# EAGLE design NodeCallerId.cg2 (EAGLE 4.16)
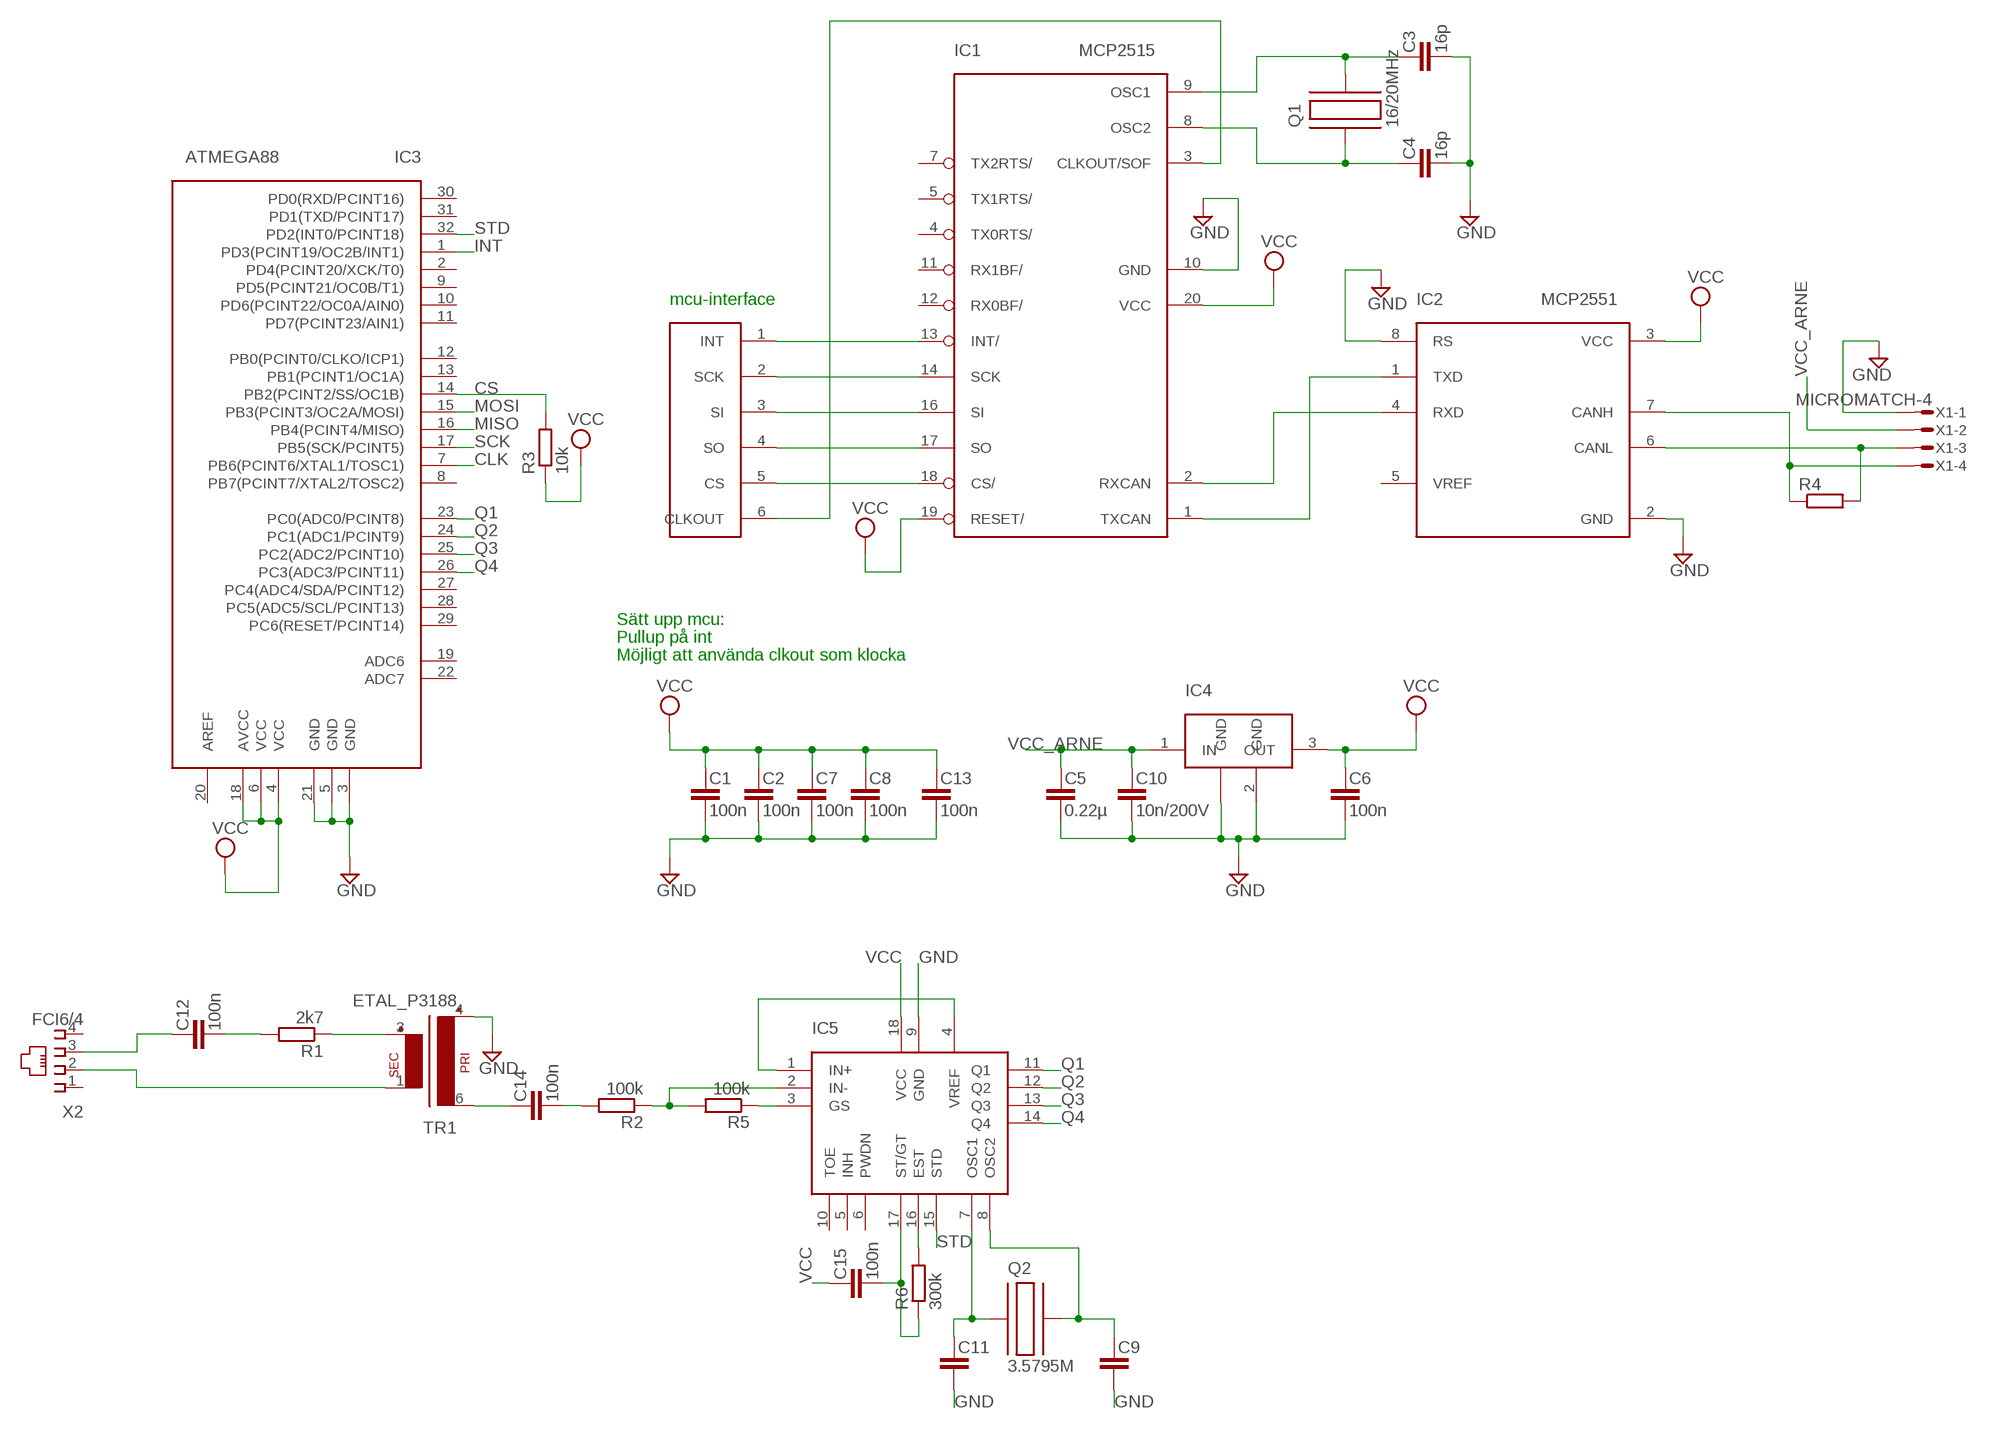
[diagram p0: schematic, sheet 1]

## Parts
C1  100n  C-EU  [C0603]
C2  100n  C-EU  [C0603]
C3  16p  C-EU  [C0603]
C4  16p  C-EU  [C0603]
C5  0.22µ  C-EU  [C0603]
C6  100n  C-EU  [C0603]
C7  100n  C-EU  [C0603]
C8  100n  C-EU  [C0603]
C9  C-EU  [C0603]
C10  10n/200V  C-EU  [C0603]
C11  C-EU  [C0603]
C12  100n  C-EU  [C0603]
C13  100n  C-EU  [C0603]
C14  100n  C-EU  [C0603]
C15  100n  C-EU  [C0603]
IC1  MCP2515  [TSSOP]
IC2  MCP2551  [SOIC]
IC3  ATMEGA88  [TQFP32]
IC4  LM340MP-5.0  [SOT223]
IC5  MT8870DIL  [DIL18]
Q1  16/20MHz  C-MAC-LFA147E  [SMD]
Q2  3.5795M  C-MAC-LFA147E  [SMD]
R1  2k7  R-EUR0603  [R0603]
R2  100k  R-EUR0603  [R0603]
R3  10k  R-EUR0603  [R0603]
R4  R-EUR0603  [R0603]
R5  100k  R-EUR0603  [R0603]
R6  300k  R-EUR0603  [R0603]
TR1  ETAL_P3188  [ETAL_P3188]
U$1  CAN-INTERFACE  [VIA-LIST]
X1  MICROMATCH-4  [MICROMATCH-4]
X2  FCI6/4  [FCI6/4]

## Nets
CANH: IC2.7(CANH) R4.1 X1.4
CANL: IC2.6(CANL) R4.2 X1.3
CLK: IC1.3(CLKOUT/SOF) IC3.7(PB6(PCINT6/XTAL1/TOSC1)) U$1.6(CLKOUT)
CS: IC1.18(CS/) IC3.14(PB2(PCINT2/SS/OC1B)) R3.2 U$1.5(CS)
GND: C1.2 C2.2 C3.2 C4.2 C5.2 C6.2 C7.2 C8.2 C9.2 C10.2 C11.2 C13.2 IC1.10(GND) IC2.2(GND) IC2.8(RS) IC3.3(GND) IC3.5(GND) IC3.21(GND) IC4.2(GND) IC4.4(GND) IC5.9(GND) TR1.4 X1.1
INT: IC1.13(INT/) IC3.1(PD3(PCINT19/OC2B/INT1)) U$1.1(INT)
MISO: IC1.17(SO) IC3.16(PB4(PCINT4/MISO)) U$1.4(SO)
MOSI: IC1.16(SI) IC3.15(PB3(PCINT3/OC2A/MOSI)) U$1.3(SI)
N$1: IC1.2(RXCAN) IC2.4(RXD)
N$2: IC1.1(TXCAN) IC2.1(TXD)
N$3: C11.1 IC5.7(OSC1) Q2.P$1
N$4: C9.1 IC5.8(OSC2) Q2.P$2
N$5: IC5.16(EST) R6.2
N$6: C15.2 IC5.17(ST/GT) R6.1
N$9: R1.1 TR1.3
N$10: C12.2 R1.2
N$11: C12.1 X2.3
N$12: C3.1 IC1.9(OSC1) Q1.P$2
N$13: C4.1 IC1.8(OSC2) Q1.P$1
N$14: TR1.1 X2.2
N$15: C14.1 TR1.6
N$16: C14.2 R2.2
N$17: IC5.2(IN-) R2.1 R5.2
N$18: IC5.3(GS) R5.1
N$19: IC5.1(IN+) IC5.4(VREF)
Q1: IC3.23(PC0(ADC0/PCINT8)) IC5.11(Q1)
Q2: IC3.24(PC1(ADC1/PCINT9)) IC5.12(Q2)
Q3: IC3.25(PC2(ADC2/PCINT10)) IC5.13(Q3)
Q4: IC3.26(PC3(ADC3/PCINT11)) IC5.14(Q4)
SCK: IC1.14(SCK) IC3.17(PB5(SCK/PCINT5)) U$1.2(SCK)
STD: IC3.32(PD2(INT0/PCINT18)) IC5.15(STD)
VCC: C1.1 C2.1 C6.1 C7.1 C8.1 C13.1 C15.1 IC1.19(RESET/) IC1.20(VCC) IC2.3(VCC) IC3.4(VCC) IC3.6(VCC) IC3.18(AVCC) IC4.3(OUT) IC5.18(VCC) R3.1
VCC_ARNE: C5.1 C10.1 IC4.1(IN) X1.2
Unconnected: IC1.4(TX0RTS/) IC1.5(TX1RTS/) IC1.7(TX2RTS/) IC1.11(RX1BF/) IC1.12(RX0BF/) IC2.5(VREF) IC3.2(PD4(PCINT20/XCK/T0)) IC3.8(PB7(PCINT7/XTAL2/TOSC2)) IC3.9(PD5(PCINT21/OC0B/T1)) IC3.10(PD6(PCINT22/OC0A/AIN0)) IC3.11(PD7(PCINT23/AIN1)) IC3.12(PB0(PCINT0/CLKO/ICP1)) IC3.13(PB1(PCINT1/OC1A)) IC3.19(ADC6) IC3.20(AREF) IC3.22(ADC7) IC3.27(PC4(ADC4/SDA/PCINT12)) IC3.28(PC5(ADC5/SCL/PCINT13)) IC3.29(PC6(RESET/PCINT14)) IC3.30(PD0(RXD/PCINT16)) IC3.31(PD1(TXD/PCINT17)) IC5.5(INH) IC5.6(PWDN) IC5.10(TOE) X2.1 X2.4

## Notes on the sheet
- mcu-interface
- Sätt upp mcu:
- Pullup på int
- Möjligt att använda clkout som klocka

## Library data of the parts
C1-C15 = rcl:C-EU
IC1 = mcp2515:MCP2515
IC2 = mcp2551:MCP2551
IC3 = atmega88:ATMEGA88
IC4 = lm340mp:LM340MP-5.0
IC5 = mitel-mt8870:MT8870
Q1 Q2 = hc49-4h-smx:C-MAC-LFA147E
R1-R6 = rcl:R-EU
TR1 = etal_trafo:ETAL_P3188
U$1 = can-interface:CAN-INTERFACE
X1 = con-amp-micromatch:MICROMATCH-4: MicroMaTch 4 7-215464-4 / 0-215464-4 Drawing Number C-215464 DDEController.pdf
X2 = fci-modular:FCI6/4

## Board
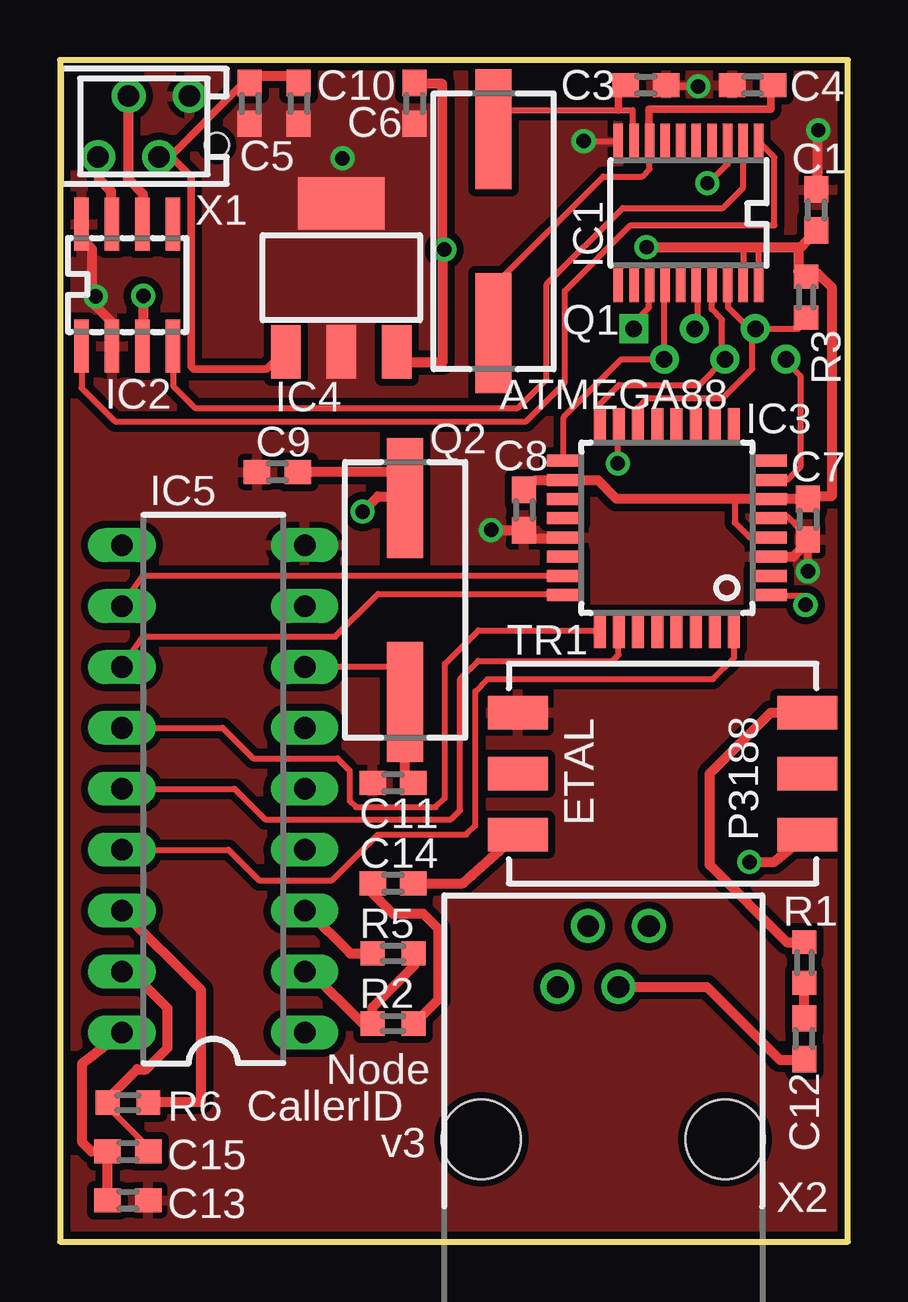
[diagram p1: board, top side]
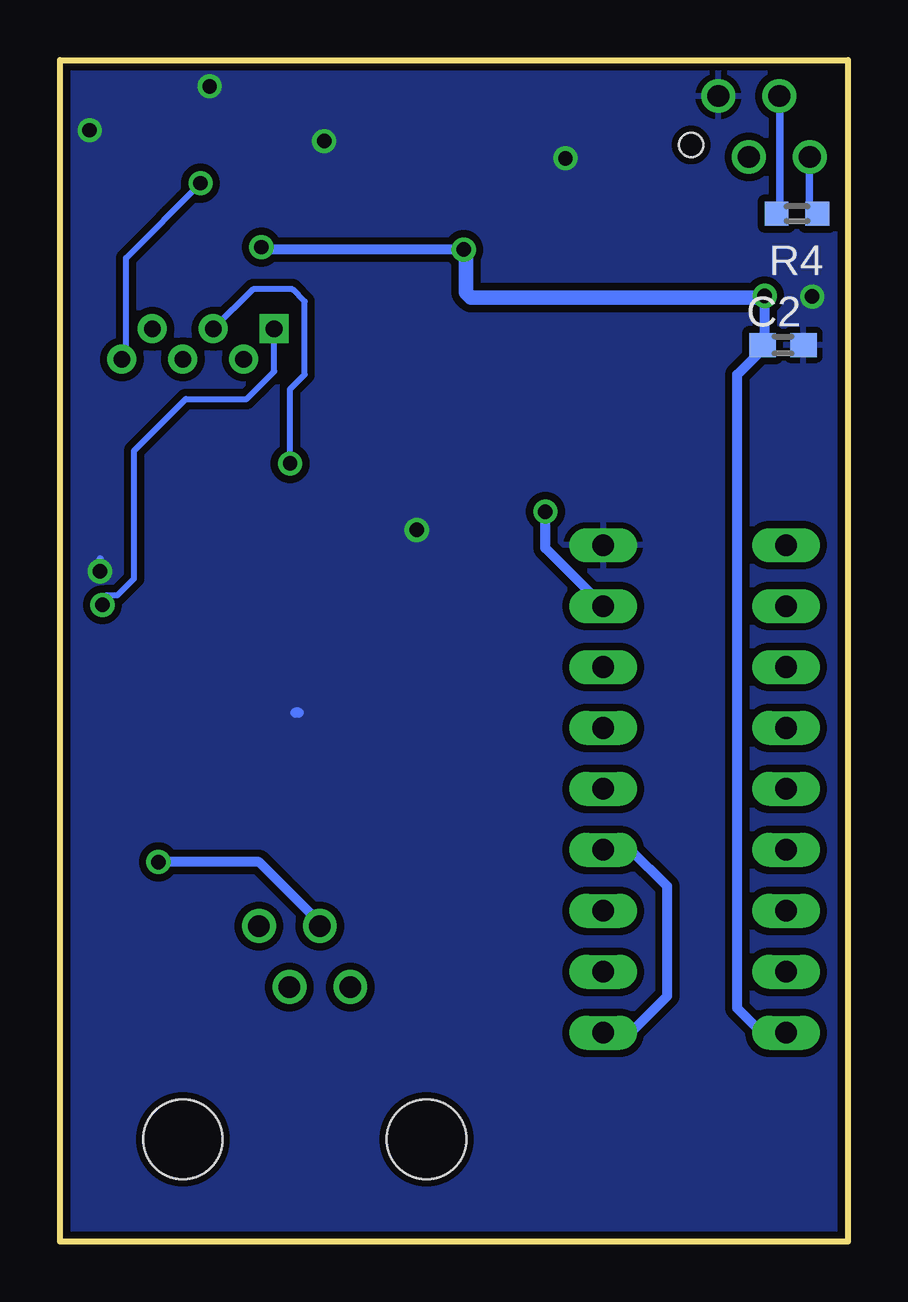
[diagram p2: board, bottom side, seen from below]

Size 32.85 x 49.26 mm. Coordinates in mm from the lower left corner, seen from the top.
Outline: 0,0 32.85,0 32.85,49.26 0,49.26 0,0
Copper layers (1*16): Top 0.035mm / dielectric 1.5mm / Bottom 0.035mm
Design rules "10mils, 0.6drill": minimum track width 10mil, minimum drill 0.6mm, track to track 10mil, track to pad 10mil, pad to pad 10mil, via to via 10mil, smd to smd 10mil, copper to edge 10mil, drill to drill 10mil, minimum pad ring 10mil, minimum via ring 8mil, stop-mask expansion 0mil, vias tented up to drill 0mil, thermal gap 10mil

### Footprints (pad centres in the part's own frame; a part is rotated, then mirrored left to right if it is on the bottom)
C0603 = smd 1.1 x 1: 1 -0.85,0; 2 0.85,0
TSSOP = smd 0.396 x 1.5: 1 -2.925,-2.975; 2 -2.275,-2.975; 3 -1.625,-2.975; 4 -0.975,-2.975; 5 -0.325,-2.975; 6 0.325,-2.975; 7 0.975,-2.975; 8 1.625,-2.975; 9 2.275,-2.975; 10 2.925,-2.975; 11 2.925,2.975; 12 2.275,2.975; 13 1.625,2.975; 14 0.975,2.975; 15 0.325,2.975; 16 -0.325,2.975; 17 -0.975,2.975; 18 -1.625,2.975; 19 -2.275,2.975; 20 -2.925,2.975
SOIC = smd 0.6 x 2.2: 1 -1.905,-2.54; 2 -0.635,-2.54; 3 0.635,-2.54; 4 1.905,-2.54; 5 1.905,2.54; 6 0.635,2.54; 7 -0.635,2.54; 8 -1.905,2.54
TQFP32 = smd 1.5 x 0.5: 1 -4.25,2.65; 2 -4.25,1.85; 3 -4.25,1.05; 4 -4.25,0.25; 5 -4.25,-0.55; 6 -4.25,-1.35; 7 -4.25,-2.15; 8 -4.25,-2.95; 17 4.25,-2.95; 18 4.25,-2.15; 19 4.25,-1.35; 20 4.25,-0.55; 21 4.25,0.25; 22 4.25,1.05; 23 4.25,1.85; 24 4.25,2.65 | smd 0.5 x 1.5: 9 -2.8,-4.4; 10 -2,-4.4; 11 -1.2,-4.4; 12 -0.4,-4.4; 13 0.4,-4.4; 14 1.2,-4.4; 15 2,-4.4; 16 2.8,-4.4; 25 2.8,4.1; 26 2,4.1; 27 1.2,4.1; 28 0.4,4.1; 29 -0.4,4.1; 30 -1.2,4.1; 31 -2,4.1; 32 -2.8,4.1
SOT223 = smd 1.219 x 2.235: 1 -2.311,-3.099; 2 0,-3.099; 3 2.311,-3.099 | smd 3.6 x 2.2: 4 0,3.099
DIL18 = drill 0.9 long: 1 -10.16,-3.81; 2 -7.62,-3.81; 3 -5.08,-3.81; 4 -2.54,-3.81; 5 0,-3.81; 6 2.54,-3.81; 7 5.08,-3.81; 8 7.62,-3.81; 9 10.16,-3.81; 10 10.16,3.81; 11 7.62,3.81; 12 5.08,3.81; 13 2.54,3.81; 14 0,3.81; 15 -2.54,3.81; 16 -5.08,3.81; 17 -7.62,3.81; 18 -10.16,3.81
SMD = smd 5 x 1.5: P$1 4.25,0; P$2 -4.25,0
R0603 = smd 0.991 x 1.016: 1 -0.85,0; 2 0.85,0
ETAL_P3188 = smd 1.4 x 2.5: 1 0,-5.08; 2 2.54,-5.08; 3 5.08,-5.08; 4 5.08,6.985; 5 2.54,6.985; 6 0,6.985
VIA-LIST = drill 0.7 square: 1 0,2.54 | drill 0.7 round: 2 -1.27,1.27; 3 0,0; 4 -1.27,-1.27; 5 0,-2.54; 6 -1.27,-3.81
MICROMATCH-4 = drill 0.9 round: 1 1.905,1.27; 2 0.635,-1.27; 3 -0.635,1.27; 4 -1.905,-1.27 | hole 1: 3.048,-0.762
FCI6/4 = drill 0.9 round: 1 -8.636,-2.794; 2 -7.366,-0.254; 3 -6.096,-2.794; 4 -4.826,-0.254 | hole 3.3: -11.811,-9.144; -1.651,-9.144

### Placement (x,y rotation side)
C1  31.54,43 90 top
C2  2.7,37.37 0 bottom
C3  24.43,48.21 0 top
C4  28.87,48.21 180 top
C5  7.92,47.45 270 top
C6  14.77,47.45 270 top
C7  31.17,30.12 270 top
C8  19.34,30.5 270 top
C9  9.06,32.08 180 top
C10  9.95,47.45 270 top
C11  13.88,19.13 180 top
C12  31.03,8.46 90 top
C13  2.84,1.73 0 top
C14  13.88,14.94 180 top
C15  2.84,3.76 0 top
IC1  26.21,42.88 180 top
IC2  2.8,39.87 0 top
IC3  25.3,29.6 180 top
IC4  11.73,40.18 0 top
IC5  6.39,18.87 90 top
Q1  18.08,42.11 270 top
Q2  14.39,26.75 270 top
R1  31.03,11.63 270 top
R2  13.88,9.09 0 top
R3  31.11,39.37 270 top
R4  2.12,42.85 180 bottom
R5  13.88,12.02 0 top
R6  2.84,5.79 0 top
TR1  26.08,16.97 90 top
U$1  26.46,38.05 90 top
X1  3.5,46.48 0 top
X2  29.38,13.41 0 top

### Tracks (layer width: path | path; a pad name or v marks a point on that pad's centre or on a via)
CANH
  Top 0.305: 2.12,42.46 IC2.7 | X1.4 1.62,45.21
  Top 0.406: 2.12,42.46 2.12,43.79 1.62,44.3 1.62,45.21
  Bottom 0.305: X1.4 1.62,45.21 1.62,43.19 R4.1
CANL
  Top 0.305: IC2.6 | X1.3 2.84,47.75
  Top 0.406: IC2.6 3.45,43.69 2.84,44.3 2.84,47.75
  Bottom 0.305: X1.3 2.84,47.75 2.84,42.99 R4.2
CLK  (via drill 0.6)
  Top 0.254: IC1.3 27.83,45.75 27.83,44.91 27.02,44.09 v26.99,44.12 | IC3.7 30.32,31.75 30.88,32.31 30.88,36.07 30.22,36.73 30.17,36.78
  Top 0.406: 30.17,36.68 30.22,36.73 U$1.6
  Bottom 0.254: v26.99,44.12 30.09,41 30.09,36.93 U$1.6
CS
  Top 0.254: IC1.18 27.83,40.03 27.86,40.03 27.86,38.94 28.87,37.92 | IC3.14 24.07,34.14 | 24.07,34.14 24.07,34.15 | 28.87,37.92 28.87,36.4 27.63,35.15 24.48,35.15 24.07,34.75 24.07,34.34 24.17,33.63 24.07,34.14 | 28.87,37.92 U$1.5 30.78,38.05 31.03,38.3 31.03,38.51 30.97,38.51 R3.2
GND  (via drill 0.6)
  Top 0.254: v21.84,45.87 23.28,45.87 IC1.10 | C1.2 31.59,44.17 | 1.34,39.14 v1.49,39.4 | 20.56,29.31 IC3.21 21.28,29.34 | C8.2 19.8,29.31 | C7.2 31.11,29.59 30.93,29.59 30.32,30.23 29.76,30.18 29.74,30.15 IC3.5 | v31.61,46.33 31.44,46.28 31.59,46.13
  Top 0.305: IC2.2 2.2,37.67 | C3.2 25.45,48.16 v26.61,48.16 | 30.93,29.59 31.16,29.59 31.18,29.57 31.18,29.06 v31.18,27.94
  Top 0.406: 2.2,37.67 2.2,38.28 1.34,39.14 1.34,41.38 0.83,41.89 IC2.8 | 19.8,29.31 20.56,29.31 | 31.59,44.17 31.59,46.13 | 31.18,29.06 31.08,29.06 30.58,28.55 IC3.3 | C8.2 18,29.65 v17.97,29.67
  Bottom 0.305: v26.61,48.16 26.56,48.23 | v31.18,27.94 31.18,28.45
  Bottom 0.406: v17.97,29.67 18.08,29.67 | 22.9,22.05 23.03,22.05
  other vias: 11.78,45.16
  pour Bottom (isolate 0.305): 0.12,49.15 32.83,49.15 32.83,0.1 24.38,0.1 0.12,0.1
  pour Top (isolate 0.305, no thermals): 5.83,48.78 15.89,48.78 15.89,35.07 5.83,35.07
  pour Top (isolate 0.305): 0.17,49.1 32.68,49.1 32.68,0.08 0.17,0.08
INT  (via drill 0.6)
  Top 0.254: IC1.13 | IC1.13 | U$1.1 23.92,38.3 24.55,38.94 24.55,39.88 IC1.13 | IC3.1 29.48,26.95 29.46,26.93 30.01,26.98 30.07,26.93 30.95,26.93 v31.08,26.54
  Bottom 0.254: v31.08,26.54 30.9,26.95 30.45,26.95 29.76,27.64 29.76,32.97 27.6,35.13 25.06,35.13 23.92,36.27 U$1.1
MISO
  Top 0.254: IC1.17 27.18,39.97 27.17,39.95 27.17,38.86 27.6,38.43 27.6,37.03 27.73,36.91 U$1.4 26.66,35.71 23.31,35.71 22.45,34.85 22.45,33.53 22.44,33.52 22.41,33.52 | IC3.16 22.41,33.52 | 22.41,33.52 22.39,33.59
MOSI  (via drill 0.6)
  Top 0.254: IC1.16 26.53,40.03 26.51,40.01 26.51,39.78 26.58,39.7 26.58,38.18 U$1.3 | IC3.15 23.3,33.98 23.26,33.94 v23.26,32.44
  Bottom 0.254: U$1.3 26.51,38.1 | U$1.3 26.41,38 | v23.26,32.44 23.26,35.53 22.65,36.14 22.65,39.19 23.16,39.7 24.81,39.7 U$1.3
N$1
  Top 0.254: 4.77,37.29 4.75,37.29 IC2.4 4.71,37.32 4.74,37.29 4.74,35.64 5.63,34.75 19.09,34.75 20.29,35.94 20.29,39.9 23.46,43.08 27.63,43.08 28.48,43.93 IC1.2
N$2
  Top 0.254: IC1.1 29.79,45.2 29.79,42.37 23.79,42.37 21.05,39.62 21.05,35.81 19.42,34.19 2.3,34.19 0.91,35.59 IC2.1 | IC2.1 0.91,37.39 | IC2.1
N$3
  Top 0.254: 14.39,22.56 Q2.P$1 14.39,23.95 IC5.7 9.69,23.95 | 14.39,19.21 C11.1
  Top 0.406: 14.39,19.21 Q2.P$1
N$4  (via drill 0.6)
  Top 0.254: 14.39,32.08 Q2.P$2 14.32,31.07
  Top 0.406: 14.39,32.08 C9.1 | v12.61,30.43 13.25,31.07 14.32,31.07
  Bottom 0.406: IC5.8 12.61,28.91 v12.61,30.43
N$5
  Top 0.254: R6.2 3.69,5.83
  Top 0.406: IC5.16 5.88,10.49 5.88,5.83 3.69,5.83
N$6
  Top 0.254: 2.84,11.25 IC5.17 | 1.95,5.79 R6.1 1.99,5.7 1.95,5.66 3.69,3.93 C15.2
  Top 0.406: 1.95,5.79 1.95,5.92 3.22,7.19 3.6,7.19 4.49,8.08 4.49,9.73 2.96,11.25 2.84,11.25
N$9
  Top 0.406: R1.1 30.31,12.48 27.09,15.7 27.09,19.51 29.63,22.05 TR1.3
N$10
  Top 0.406: C12.2 R1.2
N$11
  Top 0.254: C12.1 31.03,7.7 30.9,7.57
  Top 0.406: X2.3 26.97,10.62 30.01,7.57 30.9,7.57
N$12
  Top 0.254: IC1.9 23.87,46.2 23.87,47.17 23.28,47.17 18.13,47.17 Q1.P$2
  Top 0.305: C3.1 23.28,47.74 23.28,47.17
N$13
  Top 0.254: Q1.P$1 18.14,39.9 22.65,44.4 24.27,44.4 24.58,44.7 24.58,45.62 24.55,45.64 24.55,45.73
  Top 0.305: IC1.8 24.55,45.73 24.55,47.19 29.63,47.19 29.63,48.25 C4.1
N$14  (via drill 0.6)
  Top 0.406: v28.74,15.82 29.76,15.82 TR1.1
  Bottom 0.254: X2.2 21.89,13.16
  Bottom 0.406: v28.74,15.82 24.55,15.82 21.89,13.16
N$15
  Top 0.406: C14.1 16.81,14.94 TR1.6
N$16
  Top 0.406: C14.2 13.04,14.52 13.88,13.67 15.15,13.67 15.79,13.03 15.79,10.11 14.77,9.09 R2.2
N$17
  Top 0.406: R5.2 14.73,11.93 14.77,11.89 14.77,11.51 13.04,9.77 R2.1 12.61,9.09 10.46,11.25 IC5.2
N$18
  Top 0.406: IC5.3 10.33,13.79 12.11,12.02 R5.1
N$19
  Bottom 0.254: 9.06,16.33 IC5.4 | 9.06,8.71 IC5.1
  Bottom 0.406: 9.06,16.33 7.54,14.81 7.54,10.24 9.06,8.71
Q1
  Top 0.254: IC3.23 3.47,27.76 IC5.11
Q2
  Top 0.254: IC5.12 3.47,25.22 11.47,25.22 13.25,27 21,27 IC3.24
Q3
  Top 0.254: IC5.13 6.77,21.41 8.04,20.14 11.57,20.14 12.08,19.64 12.08,18.36 12.34,18.11 15.66,18.11 16.04,18.49 16.04,24.08 17.44,25.48 22.39,25.48 22.42,25.5 IC3.25
Q4
  Top 0.254: IC5.14 7.28,18.87 8.55,17.6 16.3,17.6 16.68,17.98 16.68,23.44 17.44,24.21 23.03,24.21 23.28,24.46 23.28,25.35 23.3,25.37 IC3.26
SCK
  Top 0.254: IC1.14 25.23,40 25.19,39.95 IC1.14 25.19,39.9 U$1.2 23.41,36.78 21,34.37 21,32.49 IC3.17
STD
  Top 0.254: IC5.15 7.03,16.33 8.3,15.06 11.34,15.06 13.25,16.97 16.93,16.97 17.31,17.35 17.31,22.94 17.82,23.44 27.22,23.44 28.11,24.33 28.11,25.35 28.1,25.36 IC3.32
VCC  (via drill 0.6)
  Top 0.254: 29.81,30.96 IC3.6 29.05,30.96 | 21.28,31.72 IC3.18 | IC1.20 29.12,40.03 29.12,41.45 29.68,41.45 | IC1.19 28.48,39.96 28.49,39.95 28.49,41.45 28.49,41.48 | 30.57,41.5 30.78,41.5 30.9,41.48 | IC3.4 28.75,29.35 28.13,29.97 28.13,30.96 | 1.99,3.72 1.95,3.76 1.82,3.76
  Top 0.406: 15.95,41.35 15.95,36.64 14.08,36.64 14.08,37.34 IC4.3 | IC2.3 3.42,37.72 3.47,38.2 v3.47,39.42 | 15.95,41.35 15.95,48.26 14.83,48.26 14.77,48.21 C6.1 | v16.02,41.35 15.95,41.35 | v24.45,41.45 28.49,41.45 29.68,41.45 | 29.68,41.45 | IC3.18 20.56,31.72 19.8,31.72 C8.1 | 29.81,30.96 30.7,30.96 C7.1 31.41,31.07 32.17,31.07 32.17,39.78 31.61,40.34 30.88,40.34 | 21.28,31.72 22.45,31.72 23.21,30.96 28.13,30.96 29.05,30.96 | 29.68,41.45 30.78,41.45 | 30.78,41.45 30.9,41.45 30.9,41.48 C1.1 | 30.88,40.34 30.88,40.25 R3.1 | 30.88,40.34 30.78,40.44 30.78,41.45 | C13.1 1.99,3.72 | IC5.18 0.93,7.44 0.93,4.14 1.31,3.76 1.95,3.76 C15.1
  Bottom 0.254: C2.1 3.47,37.87
  Bottom 0.406: 3.47,37.87 3.47,39.34 v3.47,39.42 | v24.45,41.45 24.4,41.45 24.3,41.35 v16.02,41.35 | IC5.18 3.6,8.71 4.61,9.73 4.61,36.14 3.47,37.29 3.6,37.29 3.68,37.37 | 3.68,37.37 3.73,37.42 | 3.68,37.37 C2.1
  Bottom 0.61: 3.47,39.34 15.71,39.34 15.92,39.55 15.92,41.35 v16.02,41.35
VCC_ARNE
  Top 0.254: 7.88,48.26 C5.1
  Top 0.305: IC4.1 9.31,37.08 8.61,36.37 5.58,36.37 5.48,36.47 5.48,44.4 4.67,45.21 4.26,45.21 | 7.88,48.26 7.61,48.26 4.56,45.21 4.26,45.21 | 4.26,45.21 X1.2
  Top 0.406: C10.1 9.95,48.59 7.92,48.59 C5.1

### Text on the board
tPlace: Node | CallerID | v3